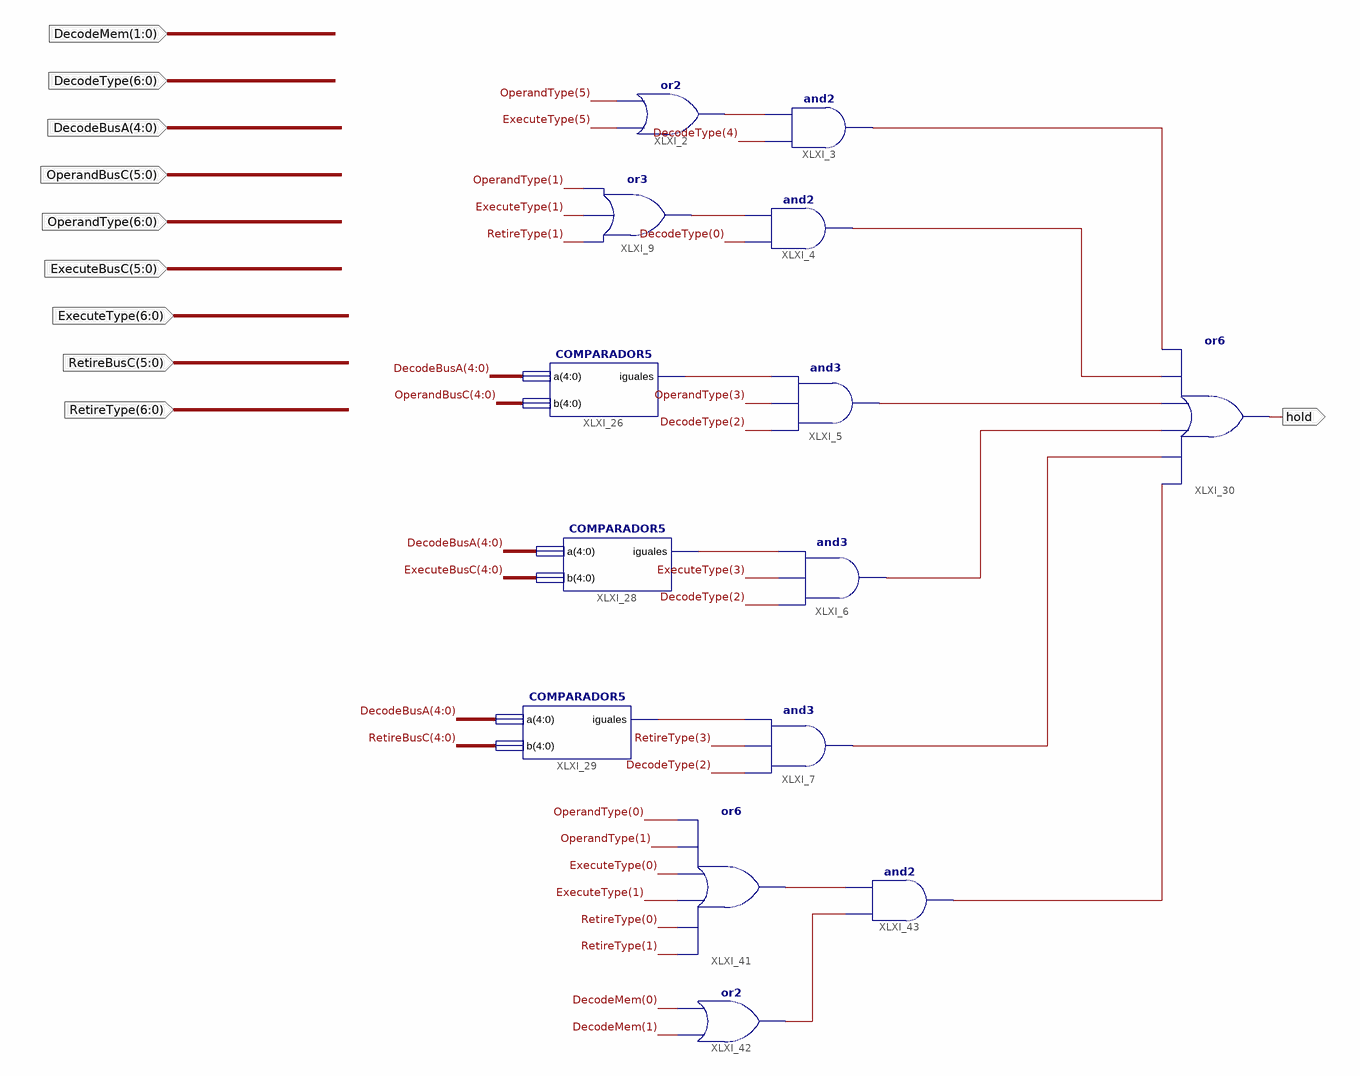
[diagram p0: schematic sheet 1]
// Xilinx ISE schematic UC2.sch (artix7) as structural Verilog: 14 symbols, 10 ports
module UC2 (
  input  [4:0] DecodeBusA,
  input  [6:0] OperandType,
  input  [5:0] OperandBusC,
  input  [5:0] ExecuteBusC,
  input  [6:0] ExecuteType,
  input  [6:0] RetireType,
  input  [5:0] RetireBusC,
  input  [6:0] DecodeType,
  input  [1:0] DecodeMem,
  output hold
);

  wire XLXN_19, XLXN_20, XLXN_41, XLXN_42, XLXN_43, XLXN_46, XLXN_47, XLXN_48, XLXN_49, XLXN_60, XLXN_76,
       XLXN_77, XLXN_78;

  and XLXI_3 (XLXN_60, DecodeType[4], XLXN_19);
  or XLXI_2 (XLXN_19, ExecuteType[5], OperandType[5]);
  or XLXI_30 (hold, XLXN_78, XLXN_49, XLXN_48, XLXN_47, XLXN_46, XLXN_60);
  and XLXI_4 (XLXN_46, DecodeType[0], XLXN_20);
  or XLXI_9 (XLXN_20, RetireType[1], ExecuteType[1], OperandType[1]);
  and XLXI_5 (XLXN_47, DecodeType[2], OperandType[3], XLXN_41);
  COMPARADOR5 XLXI_26 (.a(DecodeBusA), .b(OperandBusC[4:0]), .iguales(XLXN_41));
  and XLXI_6 (XLXN_48, DecodeType[2], ExecuteType[3], XLXN_42);
  COMPARADOR5 XLXI_28 (.a(DecodeBusA), .b(ExecuteBusC[4:0]), .iguales(XLXN_42));
  and XLXI_7 (XLXN_49, DecodeType[2], RetireType[3], XLXN_43);
  COMPARADOR5 XLXI_29 (.a(DecodeBusA), .b(RetireBusC[4:0]), .iguales(XLXN_43));
  or XLXI_41 (XLXN_76, RetireType[1], RetireType[0], ExecuteType[1], ExecuteType[0], OperandType[1], OperandType[0]);
  or XLXI_42 (XLXN_77, DecodeMem[1], DecodeMem[0]);
  and XLXI_43 (XLXN_78, XLXN_77, XLXN_76);
endmodule
